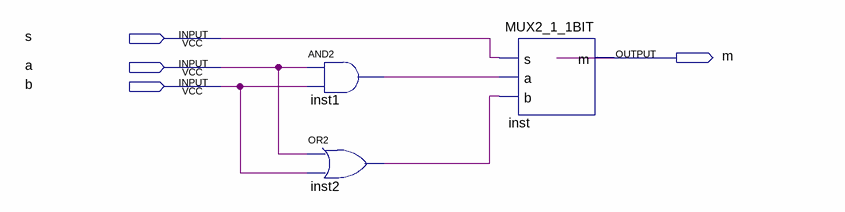
[diagram p0: schematic sheet]
// Quartus schematic ALU1BIT_2CN.bdf as structural Verilog: 3 symbols, 4 pins
module ALU1BIT_2CN (
  input  s,
  input  a,
  input  b,
  output m
);

  wire inst1_out, inst2_out;

  and inst1 (inst1_out, a, b);
  or inst2 (inst2_out, a, b);
  MUX2_1_1BIT inst (.s(s), .a(inst1_out), .b(inst2_out), .m(m));
endmodule
